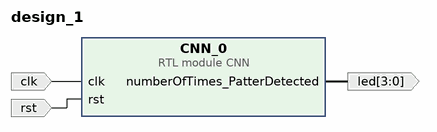
[diagram p0: block diagram of the top level]
# Vivado block design design_1, xc7z020clg400-1, Vivado 2022.1
create_bd_design design_1

create_bd_port -dir O -from 3 -to 0 led
create_bd_port -dir I -type clk clk
create_bd_port -dir I -type rst rst

create_bd_cell -type module -reference CNN CNN_0

# ---- connections ----

connect_bd_net [get_bd_pins CNN_0/numberOfTimes_PatterDetected] [get_bd_ports led]
connect_bd_net -net clk_0_1 [get_bd_ports clk] [get_bd_pins CNN_0/clk]
connect_bd_net -net rst_0_1 [get_bd_ports rst] [get_bd_pins CNN_0/rst]

validate_bd_design
save_bd_design
